# EAGLE design coracao (EAGLE 7.4.0)
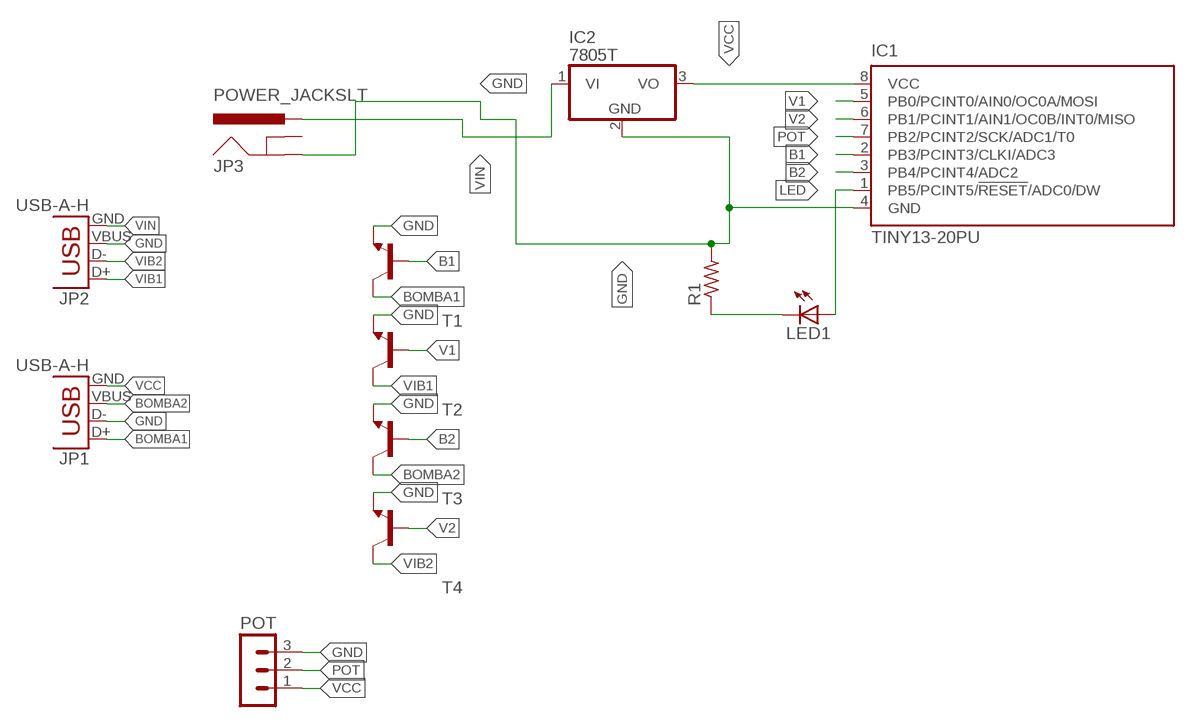
[diagram p0: schematic, sheet 1]

## Parts
IC1  TINY13-20PU  [DIL08]
IC2  7805T  [TO220H]
JP1  USB-A-H  [USB-A-H]
JP2  USB-A-H  [USB-A-H]
JP3  POWER_JACKSLT  [POWER_JACK_SLOT]
LED1  LED5MM  [LED5MM]
POT  MA03-1  [MA03-1]
R1  R-US_0207/7  [0207/7]
T1  -NPN-TO220V  [TO220V]
T2  -NPN-TO220V  [TO220V]
T3  -NPN-TO220V  [TO220V]
T4  -NPN-TO220V  [TO220V]

## Nets
B1: IC1.2(PB3/PCINT3/CLKI/ADC3) T1.1(B)
B2: IC1.3(PB4/PCINT4/ADC2) T3.1(B)
BOMBA1: JP1.D+ T1.2(C)
BOMBA2: JP1.VBUS T3.2(C)
GND: IC1.4(GND) IC2.2(GND) JP1.D- JP2.VBUS JP3.GND@2(GND) POT.3 R1.2 T1.3(E) T2.3(E) T3.3(E) T4.3(E)
LED: IC1.1(PB5/PCINT5/!RESET!/ADC0/DW) LED1.A
N$2: LED1.K(C) R1.1
POT: IC1.7(PB2/PCINT2/SCK/ADC1/T0) POT.2
V1: IC1.5(PB0/PCINT0/AIN0/OC0A/MOSI) T2.1(B)
V2: IC1.6(PB1/PCINT1/AIN1/OC0B/INT0/MISO) T4.1(B)
VCC: IC1.8(VCC) IC2.3(VO) JP1.GND POT.1
VIB1: JP2.D+ T2.2(C)
VIB2: JP2.D- T4.2(C)
VIN: IC2.1(VI) JP2.GND JP3.PWR
Unconnected: JP3.GND@1(GNDBREAK)

## Library data of the parts
IC1 = atmel:TINY13: 8-bit AVR Microcontroller with 1K Bytes In-System Programmable Flash Source: http://www.atmel.com/dyn/resources/prod_documents/2535S.pdf; MPN: ATTINY13-20PU; OC_FARNELL: 9171550; OC_NEWARK: 96K6521
IC2 = adafruit:78*: Positive VOLTAGE REGULATOR Added bigger pads to the TO-92 package
JP1 JP2 = SparkFun-Connectors:USB: USB Connectors USB-B-PTH is fully proven SKU : PRT-00139/CONN-08278 USB-miniB is fully proven SKU : PRT-00587 USB-A-PCB is untested. USB-A-H is throughly reviewed, but untested. Spark Fun Electronics SKU : PRT-00437 USB-B-SMT is throughly reviewed, but untested. Needs silkscreen touching up. USB-A-S has not been used/tested USB-MB-H has not been used/tested USB-MICROB has been used. CONN-09505; PROD_ID: CONN-08367
JP3 = SparkFun-Connectors:POWER_JACK: Power Jack This is the standard 5.5mm barrel jack for power. The PTH is the most common, proven, reliable, footprint. The Slot footprint only works if the mill layer is transmitted to the PCB fab house so be warned. Mating wall wart : TOL-00298 (and others); PROD_ID: PRT-00119
LED1 = adafruit:LED: LED OSRAM: - CHIPLED LG R971, LG N971, LY N971, LG Q971, LY Q971, LO R971, LY R971 LH N974, LH R974 LS Q976, LO Q976, LY Q976 LO Q996 - Hyper CHIPLED LW Q18S LB Q993, LB Q99A, LB R99A - SideLED LS A670, LO A670, LY A670, LG A670, LP A670 LB A673, LV A673, LT A673, LW A673 LH A674 LY A675 LS A676, LA A676, LO A676, LY A676, LW A676 LS A679, LY A679, LG A679 - Hyper Micro SIDELED® LS Y876, LA Y876, LO Y876, LY Y876 LT Y87S - SmartLED LW L88C, LW L88S LB L89C, LB L89S, LG L890 LS L89K, LO L89K, LY L89K LS L896, LA L896, LO L896, LY L896 - TOPLED LS T670, LO T670, LY T670, LG T670, LP T670 LSG T670, LSP T670, LSY T670, LOP T670, LYG T670 LG T671, LOG T671, LSG T671 LB T673, LV T673, LT T673, LW T673 LH T674 LS T676, LA T676, LO T676, LY T676, LB T676, LH T676, LSB T676, LW T676 LB T67C, LV T67C, LT T67C, LS T67K, LO T67K, LY T67K, LW E67C LS E67B, LA E67B, LO E67B, LY E67B, LB E67C, LV E67C, LT E67C LW T67C LS T679, LY T679, LG T679 LS T770, LO T770, LY T770, LG T770, LP T770 LB T773, LV T773, LT T773, LW T773 LH T774 LS E675, LA E675, LY E675, LS T675 LS T776, LA T776, LO T776, LY T776, LB T776 LHGB T686 LT T68C, LB T68C - Hyper Mini TOPLED® LB M676 - Mini TOPLED Santana® LG M470 LS M47K, LO M47K, LY M47K Source: http://www.osram.convergy.de/
POT = con-lstb:MA03-1: PIN HEADER; OC_FARNELL: unknown; OC_NEWARK: unknown
R1 = adafruit:R-US_: RESISTOR, American symbol
T1-T4 = transistor:*-NPN-: NPN Transistror BF959 corrected 2008.03.06

## Board
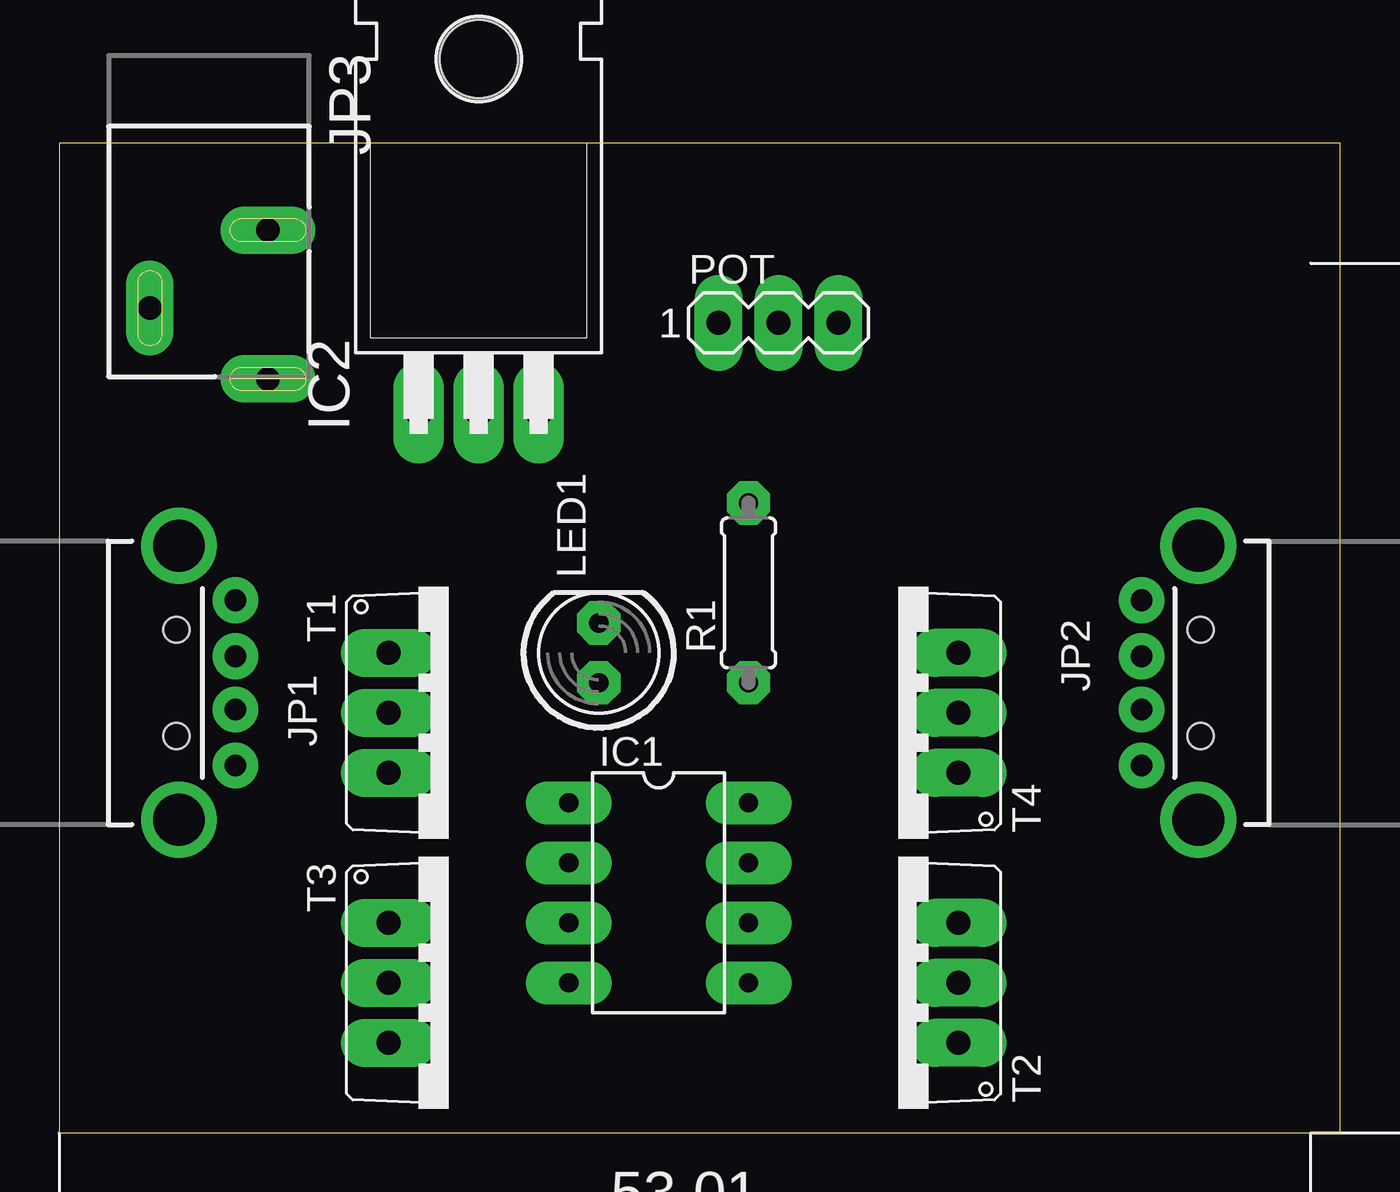
[diagram p1: board, top side]
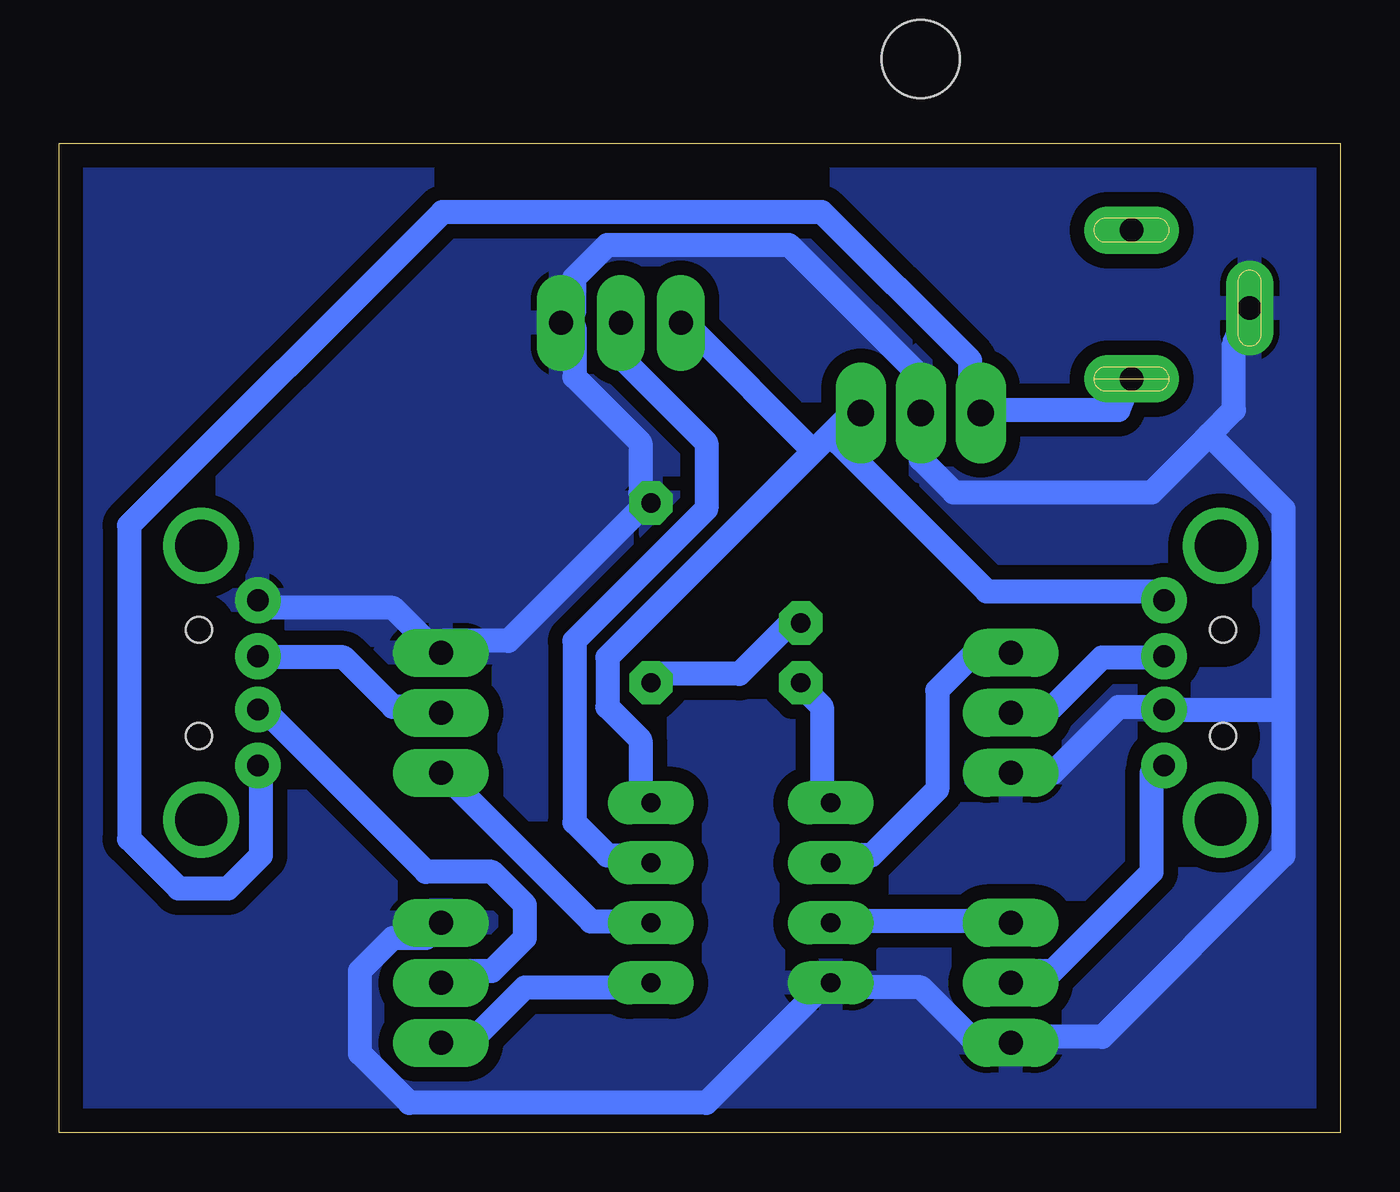
[diagram p2: board, bottom side, seen from below]

Size 54.28 x 41.9 mm. Coordinates in mm from the lower left corner, seen from the top.
Outline: 0,0 54.28,0 54.28,41.9 0,41.9 0,0
Copper layers 16: Bottom 0.035mm
Design rules "default *": minimum track width 40mil, minimum drill 20mil, track to track 15mil, track to pad 15mil, pad to pad 15mil, via to via 15mil, smd to smd 8mil, copper to edge 40mil, drill to drill 8mil, minimum pad ring 20mil, minimum via ring 8mil, stop-mask expansion 4mil, vias tented up to drill 0mil, thermal gap 10mil

### Footprints (pad centres in the part's own frame; a part is rotated, then mirrored left to right if it is on the bottom)
DIL08 = drill 0.813 long: 1 -3.81,-3.81; 2 -1.27,-3.81; 3 1.27,-3.81; 4 3.81,-3.81; 5 3.81,3.81; 6 1.27,3.81; 7 -1.27,3.81; 8 -3.81,3.81
TO220H = drill 1.118 long: 1 -2.54,-10.16; 2 0,-10.16; 3 2.54,-10.16 | hole 3.302: 0,4.826
USB-A-H = drill 0.914 pad 1.88: D+ 2.4,1.127; D- 2.4,-1.127; GND 2.4,3.5; VBUS 2.4,-3.5 | drill 2.2: GND2 0,-5.8; GND3 0,5.8 | hole 1.1: -0.1,2.25; -0.1,-2.25
POWER_JACK_SLOT = drill 1 pad 2 long: GND@1 2.58,7.5; GND@2 7.58,10.8; PWR 2.58,13.8
LED5MM = drill 0.813 pad 1.676 octagon: A -1.27,0; K 1.27,0
MA03-1 = drill 1.016 long: 1 -2.54,0; 2 0,0; 3 2.54,0
0207/7 = drill 0.813 octagon: 1 -3.81,0; 2 3.81,0
TO220V = drill 1.016 long: 1 -2.54,-2.54; 2 0,-2.54; 3 2.54,-2.54

### Placement (x,y rotation side)
IC1  25.4,10.16 270 top
IC2  17.78,40.64 0 top
JP1  5.08,19.05 0 top
JP2  48.26,19.05 180 top
JP3  11.43,45.72 180 top
LED1  22.86,20.32 90 top
POT  30.48,34.29 0 top
R1  29.21,22.86 90 top
T1  16.51,17.78 270 top
T2  35.56,6.35 90 top
T3  16.51,6.35 270 top
T4  35.56,17.78 90 top

### Tracks (layer width: path | path; a pad name or v marks a point on that pad's centre or on a via)
B1
  Bottom 1.016: IC1.2 21.27,11.75 19.88,11.75 17.08,14.54 17.08,18.73 15.68,20.13 14.29,20.13 T1.1
B2
  Bottom 1.016: IC1.3 21.27,8.95 14.29,8.95 T3.1
BOMBA1
  Bottom 1.016: JP1.D+ 8,20.13 10.1,20.13 12.19,18.03 13.59,18.03 T1.2
BOMBA2
  Bottom 1.016: JP1.VBUS 8,15.24 8,11.05 12.19,6.86 13.59,6.86 T3.2
GND
  Bottom 1.016: T2.3 38.73,8.26 40.13,8.26 41.53,6.86 41.53,3.37 39.43,1.27 26.86,1.27 21.97,6.16 IC1.4 21.27,6.16 17.78,6.16 15.68,4.06 14.29,4.06 T3.3 13.59,4.06 10.1,4.06 2.41,11.75 2.41,17.92 | 5.56,29.56 8,27.11 16.38,27.11 17.78,28.51 IC2.2 17.78,32 23.37,37.59 31.05,37.59 32.45,36.2 32.45,34.8 POT.3 32.45,34.1 32.45,32 29.65,29.21 29.65,27.11 R1.2 29.65,26.42 35.24,20.83 38.04,20.83 T4.3 38.73,20.83 40.13,22.22 45.72,22.22 JP2.VBUS | 5.56,29.56 4.51,30.61 4.51,33.4 JP3.GND@2 | 2.41,17.92 2.41,26.42 5.56,29.56 | T1.3 12.19,15.24 9.4,18.03 8,18.03 JP1.D- 2.41,17.92
  pour Bottom (isolate 0.61): 0,40.64 53.34,40.64 53.34,0 0,0
LED
  Bottom 1.016: IC1.1 21.97,14.54 21.97,18.03 22.67,18.73 LED1.A
N$2
  Bottom 1.016: R1.1 28.96,19.43 25.46,19.43 23.37,21.53 LED1.K
POT
  Bottom 1.016: IC1.7 29.65,11.75 31.05,11.75 32.45,13.14 32.45,20.83 26.86,26.42 26.86,29.21 30.35,32.7 30.35,34.1 POT.2
V1
  Bottom 1.016: IC1.5 29.65,6.16 34.54,6.16 36.64,4.06 38.04,4.06 T2.1
V2
  Bottom 1.016: IC1.6 29.65,8.95 31.75,8.95 38.04,15.24 T4.1
VCC
  Bottom 1.016: 22.32,28.86 20.57,30.61 IC2.3 21.27,29.21 14.99,22.92 8,22.92 JP1.GND | 22.32,28.86 31.05,20.13 31.05,18.03 29.65,16.64 29.65,14.54 IC1.8 | 22.32,28.86 27.56,34.1 POT.1
VIB1
  Bottom 1.016: JP2.D+ 45.72,18.03 38.73,11.05 35.94,11.05 34.54,9.65 34.54,8.26 35.94,6.86 38.04,6.86 T2.2
VIB2
  Bottom 1.016: JP2.D- 45.72,20.13 42.23,20.13 40.13,18.03 38.73,18.03 T4.2
VIN
  Bottom 1.016: JP2.GND 45.72,15.24 45.72,11.75 47.12,10.35 49.21,10.35 51.31,12.45 51.31,25.72 38.04,38.99 21.97,38.99 15.68,32.7 15.68,30.61 IC2.1 14.99,30.61 9.4,30.61 JP3.PWR